# Altium project Ground.PrjPCB
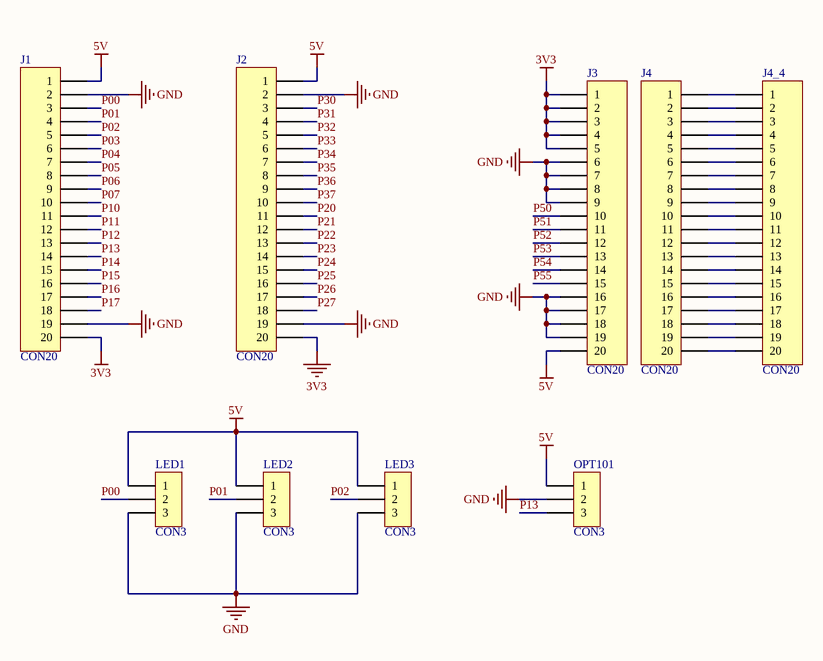
[diagram p0: S_ground.SchDoc]
1 sheet, 9 parts. Net scope: global (net labels, ports and power ports of the same name join across sheets).
Board file: P_ground.PcbDoc

## Sheet S_ground.SchDoc
size A4

### Parts
J1  CON20  [sip-20]
J2  CON20  [sip-20]
J3  CON20  [sip-20]
J4  CON20  [sip-20]
J4_4  CON20  [sip-20]
LED1  CON3  [SIP-3]
LED2  CON3  [SIP-3]
LED3  CON3  [SIP-3]
OPT101  CON3  [SIP-3]

### Nets
3V3: J1.20 J2.20 J3.1 J3.2 J3.3 J3.4 J3.5
5V: J1.1 J2.1 J3.20 LED1.1 LED2.1 LED3.1 OPT101.1
GND: J1.2 J1.19 J2.2 J2.19 J3.6 J3.7 J3.8 J3.9 J3.16 J3.17 J3.18 J3.19 LED1.3 LED2.3 LED3.3 OPT101.2
P00: J1.3 LED1.2
P01: J1.4 LED2.2
P02: J1.5 LED3.2
P03: J1.6
P04: J1.7
P05: J1.8
P06: J1.9
P07: J1.10
P10: J1.11
P11: J1.12
P12: J1.13
P13: J1.14 OPT101.3
P14: J1.15
P15: J1.16
P16: J1.17
P17: J1.18
P20: J2.11
P21: J2.12
P22: J2.13
P23: J2.14
P24: J2.15
P25: J2.16
P26: J2.17
P27: J2.18
P30: J2.3
P31: J2.4
P32: J2.5
P33: J2.6
P34: J2.7
P35: J2.8
P36: J2.9
P37: J2.10
P50: J3.10
P51: J3.11
P52: J3.12
P53: J3.13
P54: J3.14
P55: J3.15
NetJ4_1: J4.1 J4_4.1
NetJ4_2: J4.2 J4_4.2
NetJ4_3: J4.3 J4_4.3
NetJ4_4: J4.4 J4_4.4
NetJ4_5: J4.5 J4_4.5
NetJ4_6: J4.6 J4_4.6
NetJ4_7: J4.7 J4_4.7
NetJ4_8: J4.8 J4_4.8
NetJ4_9: J4.9 J4_4.9
NetJ4_10: J4.10 J4_4.10
NetJ4_11: J4.11 J4_4.11
NetJ4_12: J4.12 J4_4.12
NetJ4_13: J4.13 J4_4.13
NetJ4_14: J4.14 J4_4.14
NetJ4_15: J4.15 J4_4.15
NetJ4_16: J4.16 J4_4.16
NetJ4_17: J4.17 J4_4.17
NetJ4_18: J4.18 J4_4.18
NetJ4_19: J4.19 J4_4.19
NetJ4_20: J4.20 J4_4.20

### Library data of the parts
J1-J4 J4_4 = CON20: Connector
LED1-LED3 OPT101 = CON3: Connector